# Altium schematic sheet Sensors.SchDoc
size A4; SheetNumber: 2; SheetTotal: 3
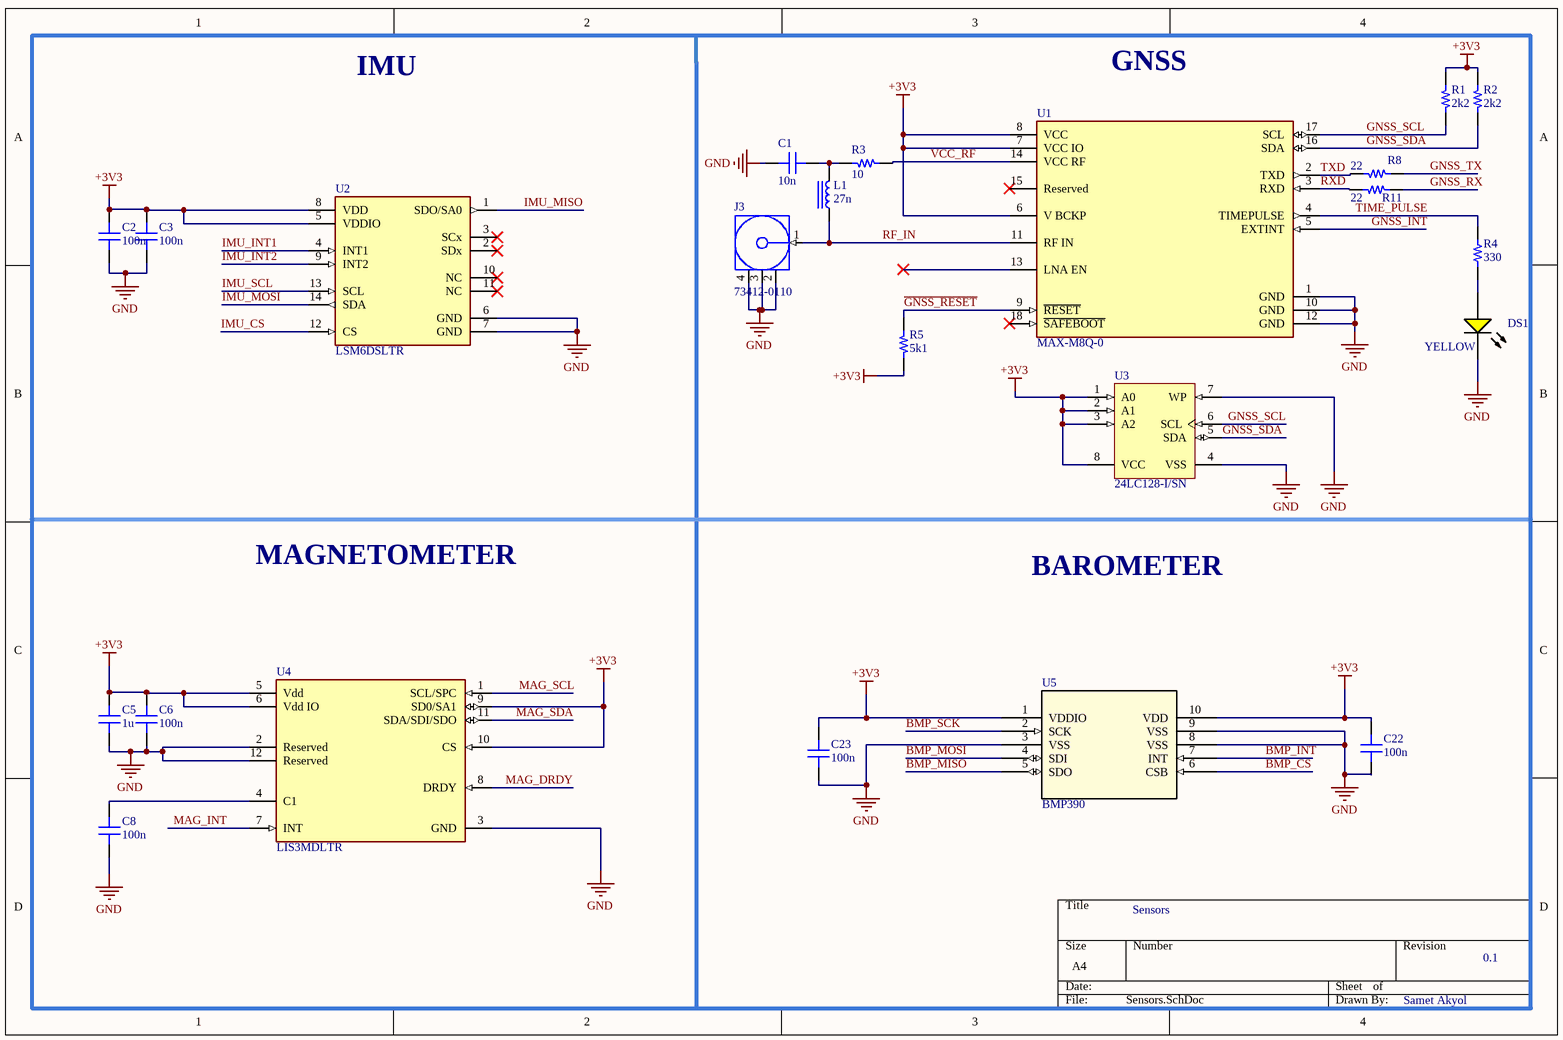
[diagram p0: Sensors.SchDoc]

## Parts
C1  10n  [CAP 0402_1005]
C2  100n  [CAP 0402_1005]
C3  100n  [CAP 0402_1005]
C5  1u  [CAP 0402_1005]
C6  100n  [CAP 0402_1005]
C8  100n  [CAP 0402_1005]
C22  100n  [CAP 0402_1005]
C23  100n  [CAP 0402_1005]
DS1  YELLOW  [VISH-TLMY1000_V]
J3  73412-0110  [MOLX-73412-0110_V]
L1  27n  [IND 0402_1005 RF WW]
R1  2k2  [RES 0402_1005]
R2  2k2  [RES 0402_1005]
R3  10  [RES 0402_1005]
R4  330  [RES 0603_1608]
R5  5k1  [RES 0402_1005]
R8  22  [RES 0402_1005]
R11  22  [RES 0402_1005]
U1  MAX-M8Q-0  [FP-MAX-M8Q-0-MFG]
U2  LSM6DSLTR  [FP-LGA-14L-DM00249496-MFG]
U3  24LC128-I/SN  [SOIC-SN8_M]
U4  LIS3MDLTR  [FP-VFLGA-12-8365767-MFG]
U5  BMP390  [10LGA_2X2X0p75_BOS-L]

## Nets
+3V3: C2.2 C3.2 C5.2 C6.2 C22.2 C23.2 R1.2 R2.2 R5.1 U1.6(V_BCKP) U1.7(VCC_IO) U1.8(VCC) U2.5(VDDIO) U2.8(VDD) U3.1(A0) U3.2(A1) U3.3(A2) U3.8(VCC) U4.5(Vdd) U4.6(Vdd_IO) U4.9(SD0/SA1) U4.10(CS) U5.1(VDDIO) U5.10(VDD)
GND: C1.2 C2.1 C3.1 C5.1 C6.1 C8.1 C22.1 C23.1 DS1.2(K) J3.2(GND) J3.3(GND) J3.4(GND) U1.1(GND) U1.10(GND) U1.12(GND) U2.6(GND) U2.7(GND) U3.4(VSS) U3.7(WP) U4.2(Reserved) U4.3(GND) U4.12(Reserved) U5.3(VSS) U5.8(VSS) U5.9(VSS)
BMP_CS: U5.6(CSB)
BMP_INT: U5.7(INT)
BMP_MISO: U5.5(SDO)
BMP_MOSI: U5.4(SDI)
BMP_SCK: U5.2(SCK)
~{GNSS_RESET}: R5.2 U1.9(~{RESET})
GNSS_INT: U1.5(EXTINT)
GNSS_RX: R11.1
GNSS_SCL: R1.1 U1.17(SCL) U3.6(SCL)
GNSS_SDA: R2.1 U1.16(SDA) U3.5(SDA)
GNSS_TX: R8.1
IMU_CS: U2.12(CS)
IMU_INT1: U2.4(INT1)
IMU_INT2: U2.9(INT2)
IMU_MISO: U2.1(SDO/SA0)
IMU_MOSI: U2.14(SDA)
IMU_SCL: U2.13(SCL)
MAG_DRDY: U4.8(DRDY)
MAG_INT: U4.7(INT)
MAG_SCL: U4.1(SCL/SPC)
MAG_SDA: U4.11(SDA/SDI/SDO)
RF_IN: J3.1(SIGNAL) L1.2 U1.11(RF_IN)
RXD: R11.2 U1.3(RXD)
TIME_PULSE: R4.2 U1.4(TIMEPULSE)
TXD: R8.2 U1.2(TXD)
VCC_RF: R3.2 U1.14(VCC_RF)
NetC1_1: C1.1 L1.1 R3.1
NetC8_2: C8.2 U4.4(C1)
NetDS1_1: DS1.1(A) R4.1

Not connected (* = marked no-connect by the designer): U1 13(LNA_EN)* 15(Reserved)* 18(~{SAFEBOOT})*; U2 2(SDx)* 3(SCx)* 10(NC)* 11(NC)*

## Notes on the sheet
- IMU <https://www.st.com/resource/en/datasheet/lsm6dsl.pdf>
- GNSS <https://www.u-blox.com/en/product/max-m8-series?legacy=Current#Documentation-&-resources>
- MAGNETOMETER
- BAROMETER
- Sensors
- 0.1
- Samet Akyol

## Library data of the parts
C1 = C0402C151F5GAC7867: CAP CER 150PF 50V NP0 0402; manufacturer: KEMET; Temperature Coefficient: C0G, NP0; Tolerance: ±1%; Part Number: C0402C151F5GAC7867; Value: 10n; Applications: General Purpose; Capacitance: 150 pF; componentlink1description: Datasheet; componentlink1url: https://api.kemet.com/component-edge/download/datasheet/C0402C151F5GAC7867.pdf; componentlink2description: DigiKey Link; componentlink2url: https://www.digikey.com/en/products/detail/kemet/C0402C151F5GAC7867/2196312; Device Package: 0402 (1005 Metric); Features: Low ESL; lastupdated: 9.02.2024 20:04:38; Lifecycle Status: Active; Minimum Order: 1; Mounting Type: Surface Mount, MLCC; Operating Temperature: -55°C ~ 125°C; Package / Case: 0402 (1005 Metric); packaging: TapeAndReel; partid: 1709; Part Status: Active; price: 0.40; series: SMD Comm C0G; Size / Dimension: 0.039" L x 0.020" W (1.00mm x 0.50mm); Supplier 1: DigiKey; Supplier Part Number 1: 399-14269-1-ND; Thickness (Max): 0.022" (0.55mm); Voltage - Rated: 50V
C2 C3 C5 C6 C8 C22 C23 = MD0402BB104K100NGHT-EM: CAP CER 0.1UF 10V X7R 0402; manufacturer: Knowles Novacap; Capacitance: 0.1 µF; Tolerance: ±10%; Part Number: MD0402BB104K100NGHT-EM; Applications: Medical, Non-Critical; componentlink1description: Datasheet; componentlink1url: https://mm.digikey.com/Volume0/opasdata/d220001/medias/docus/5546/MD Series R3.pdf; componentlink2description: DigiKey Link; componentlink2url: https://www.digikey.com/en/products/detail/knowles-novacap/MD0402BB104K100NGHT-EM/21406861; Device Package: 0402 (1005 Metric); lastupdated: 9.02.2024 20:03:17; Lifecycle Status: Active; Minimum Order: 1; Mounting Type: Surface Mount, MLCC; Operating Temperature: -55°C ~ 125°C; Package / Case: 0402 (1005 Metric); packaging: TapeAndReel; partid: 56675; price: 1.21; series: MD; Supplier 1: DigiKey; Supplier Part Number 1: 1763-MD0402BB104K100NGHT-EMCT-ND; Temperature Coefficient: X7R; Voltage - Rated: 10V
  C2 C3 C6 C8 C22 C23: Value: 100n
  C5: Value: 1u
DS1 = CMP-2000-07255-1: Low Current LED, 40 mW, -40 to 100 degC, 2-Pin SMD, RoHS, Tape and Reel; Manufacturer: Vishay; Wavelength Typ: 595nm; Forward Current If: 2mA; Viewing Angle: 80°; Bulb Size: 1.6mmx0.8mm; Forward Voltage: 1.8V; Luminous Intensity: 7.5mcd; SVHC: ToBeAdvised; Automotive Qualification Standard: AEC-Q100; Lens Shape: Rectangular; LED Mounting: SMD; Mounting Technology: SurfaceMount; Packaging: CutTape; MSL: MSL2-1year; Datasheet URL: http://www.vishay.com/docs/83172/tlmo1000.pdf; Package Reference: TLMY1000; Manufacturer URL: http://www.vishay.com/; Package Description: 2-Pin Surface Mount Device, Body 1.6 x 0.8 mm; LED Colour: Yellow; Datasheet Version: Rev. 2.0, 09/2013; Product Range: -
J3 = CMP-1676-00003-1: MCRF, PCB Vertical Jack Receptacle, 50 Ohm, 4-Pin SMD, RoHS, Tape and Reel; Voltage Rating (AC): 60 V; Mating Cycles: 30; Impedance: 50 Ohm; Frequency: 6 Hz; Gender: Female; RoHSCompliant: true; Length: 3 mm; DatasheetVersion: 04/2016; ComponentLink3URL: http://www.molex.com/pdm_docs/sd/734120110_sd.pdf; Max Operating Temperature: 90 degC; Contact Material: Bronze; Mount: Surface Mount; ComponentLink2Description: Datasheet; Packaging: Tape and Reel; Radiation Hardening: No; Voltage Rating: 60 V; Mounting Technology: Surface Mount; ComponentLink1Description: Manufacturer URL; ComponentLink1URL: http://www.molex.com/; Width: 3 mm; ComponentLink3Description: Package Specification; Package Quantity: 5000; PackageReference: 73412-0110; Min Operating Temperature: -40 degC; Height: 1.25 mm; REACH SVHC: Unknown; ComponentLink2URL: http://www.molex.com/webdocs/datasheets/pdf/en-us/0734120110_RF_COAX_CONNECTORS.pdf; Contact Plating: Gold; PackageDescription: 4-Leads SMD, Body 2.6 x 2.6 mm; PackageVersion: Rev. C14, 07/2015
L1 = LQW15CNR16J00D: FIXED IND 160NH 480MA 0.33OHM SM; Manufacturer: Murata Electronics; DC Resistance (DCR): 330mOhm Max; Frequency - Self Resonant: 900MHz; Inductance Frequency - Test: 100 MHz; Material - Core: Ferrite; Shielding: Unshielded; Tolerance: ±5%; Type: Drum Core, Wirewound; Part Number: LQW15CNR16J00D; ComponentLink1Description: Datasheet; ComponentLink1URL: https://search.murata.co.jp/Ceramy/image/img/P02/JELF243A-0087.pdf; ComponentLink2Description: DigiKey Link; ComponentLink2URL: https://www.digikey.com/en/products/detail/murata-electronics/LQW15CNR16J00D/4359664; Current Rating (Amps): 480 mA; Device Package: 0402 (1005 Metric); Height - Seated (Max): 0.024" (0.60mm); Inductance: 160 nH; LastUpdated: 11.03.2024 07:55:42; Lifecycle Status: Active; Minimum Order: 1; Mounting Type: Surface Mount; Operating Temperature: -55°C ~ 125°C; Package / Case: 0402 (1005 Metric); Packaging: TapeAndReel; PartId: 1; Part Status: Active; Price: 0.19; Series: LQW15; Size / Dimension: 0.039" L x 0.024" W (1.00mm x 0.60mm); Supplier 1: DigiKey; Supplier Part Number 1: 490-14716-1-ND; Value: 160 nH
R1-R3 R5 R8 R11 = RP73PF1E249KBTD: RES 249K OHM 0.1% 1/10W 0402; Manufacturer: TE Connectivity Passive Product; Power (Watts): 0.1W, 1/10W; Resistance: 249 kOhms; Temperature Coefficient: ±25ppm/°C; Part Number: RP73PF1E249KBTD; ComponentLink1Description: Datasheet; ComponentLink1URL: https://www.te.com/commerce/DocumentDelivery/DDEController?Action=srchrtrv&DocNm=1773272&DocType=DS&DocLang=English; ComponentLink2Description: DigiKey Link; ComponentLink2URL: https://www.digikey.com/en/products/detail/te-connectivity-passive-product/RP73PF1E249KBTD/8261091; Composition: Thin Film; Device Package: 0402 (1005 Metric); Height - Seated (Max): 0.014" (0.35mm); LastUpdated: 9.02.2024 20:30:24; Lifecycle Status: Active; Minimum Order: 1; Number of Terminations: 2; Operating Temperature: -55°C ~ 155°C; Package / Case: 0402 (1005 Metric); Packaging: TapeAndReel; PartId: 2418; Part Status: Active; Price: 0.07; Series: RP73, Holsworthy; Size / Dimension: 0.039" L x 0.020" W (1.00mm x 0.50mm); Supplier 1: DigiKey; Supplier Part Number 1: A127549CT-ND; Supplier Device Package: 0402; Tolerance: ±0.1%
  R1 R2: Value: 2k2
  R3: Value: 10
  R5: Value: 5k1
  R8 R11: Value: 22
R4 = CRGH0603F330R: RES SMD 330 OHM 1% 1/5W 0603; Manufacturer: TE Connectivity Passive Product; Power (Watts): 0.2W, 1/5W; Resistance: 330 Ohms; Temperature Coefficient: ±100ppm/°C; Part Number: CRGH0603F330R; Value: 330; ComponentLink1Description: Datasheet; ComponentLink1URL: https://www.te.com/commerce/DocumentDelivery/DDEController?Action=srchrtrv&DocNm=1773204-1&DocType=DS&DocLang=English; ComponentLink2Description: DigiKey Link; ComponentLink2URL: https://www.digikey.com/en/products/detail/te-connectivity-passive-product/CRGH0603F330R/5586961; Composition: Thick Film; Device Package: 0603 (1608 Metric); Height - Seated (Max): 0.022" (0.55mm); LastUpdated: 9.02.2024 20:43:33; Lifecycle Status: Active; Minimum Order: 1; Number of Terminations: 2; Operating Temperature: -55°C ~ 155°C; Package / Case: 0603 (1608 Metric); Packaging: TapeAndReel; PartId: 5733; Part Status: Active; Price: 0.01; Series: CRGH, Neohm; Size / Dimension: 0.063" L x 0.031" W (1.60mm x 0.80mm); Supplier 1: DigiKey; Supplier Part Number 1: A129541CT-ND; Supplier Device Package: 0603; Tolerance: ±1%
U1 = CMP-207130-000017-1: RF RCVR GNSS/GPS 1.575GHZ 18LCC; Sensitivity: -167dBm; Current - Receiving: 23mA; Interface: I2C; Frequency: 1.575GHz; Min Operating Temperature: -40°C; Case/Package: SMD/SMT; RoHS Compliant: Yes; Packaging: Cut Tape; Max Operating Temperature: 85°C
U2 = CMP-2000-07467-2: IMU ACCEL/GYRO I2C/SPI 14LGA; Manufacturer: STMicroelectronics; Resolution: 16bits; Max Supply Voltage: 3.6V; Sensor Type: Temperature,Accelerometer,Gyroscope; Sensor Output: I2C,SPI; Gyro Range: 125/250/500/1000/2000°/s; Accel Range: 2/4/8/16g; Operating Supply Current: 0.29-0.65mA; Min Supply Voltage: 1.62V; Package: LGA-14L-DM00249496; Temperature Range High: +85°C; Automotive: No; Footprint Url: https://www.st.com/resource/en/technical_note/cd00134799.pdf; Height: 0.86mm; Device Class L1: Sensors; Octopart: https://octopart.com/lsm6dsltr-stmicroelectronics-66358193; Device Class L2: Motion Sensors; Lead Free: Yes; Category: IC; Device Class L3: Inertial Measurement Units (IMUs); ComponentLink2Description: Datasheet; RoHS: TRUE; ComponentLink2URL: https://www.st.com/resource/en/datasheet/lsm6dsl.pdf; Temperature Range Low: -40°C; Manufacturer Part Number: LSM6DSLTR; Mouser Description: iNEMO inertial module: always-on 3D accelerometer and 3D gyroscope; Digikey Description: IMU ACCEL/GYRO I2C/SPI 14LGA; Temperature: -40°C to +85°C
U3 = CMP-0159-00176-1: 128Kbit, 400kHz, 2.5V, I2C Serial EEPROM, 8-Pin SOIC 150mil, Industrial Temperature; PackageReference: SOIC-SN8; Code_JEDEC: MS-012; DatasheetVersion: revR, Apr-2009; PackageVersion: revBB, Aug-2009; Code_IPC: SOIC127P600-8; PackageDescription: 8-Lead Plastic Small Outline (SN) - Narrow, 3.90mm Body [SOIC]
U4 = CMP-2000-07463-2: SENSOR MR I2C/SPI 12LGA; Manufacturer: STMicroelectronics; Sensor Output: I2C,SPI; Operating Supply Current: 40-270uA; Max Supply Voltage: 3.6V; Sensing Method: Magnetic; Min Supply Voltage: 1.71V; ComponentLink2URL: https://www.st.com/resource/en/datasheet/lis3mdl.pdf; Category: IC; Manufacturer Part Number: LIS3MDLTR; Octopart: https://octopart.com/lis3mdltr-stmicroelectronics-29403125; Automotive: No; ComponentLink2Description: Datasheet; RoHS: TRUE; Device Class L3: unset; Device Class L1: Sensors; Temperature: -40°C to +85°C; Height: 1mm; Mouser Description: Board Mount Hall Effect / Magnetic Sensors Ultra Lo-Pwr Hi Perf 3-Axis 1.9-3.6V; Temperature Range High: +85°C; Lead Free: Yes; Device Class L2: Magnetic Sensors; Footprint Url: https://www.st.com/content/ccc/resource/technical/document/technical_note/73/17/9c/16/dd/96/4a/01/CD00134799.pdf/files/CD00134799.pdf/jcr:content/translations/en.CD00134799.pdf; Temperature Range Low: -40°C; Package: VFLGA-12-8365767; Digikey Description: SENSOR MR I2C/SPI 12LGA
U5 = BMP390: No Description Available; Mfr_Name: Bosch Sensortec; RefDes: RefDes; Type: Type